# Altium schematic sheet PWL File.SchDoc: PWL File
size A4; Organization: Altium Limited; Address1: L3, 12a Rodborough Rd; Address2: Frenchs Forest; Address3: NSW; Address4: Australia 2086; DocumentNumber: 1; SheetNumber: 1; SheetTotal: 1
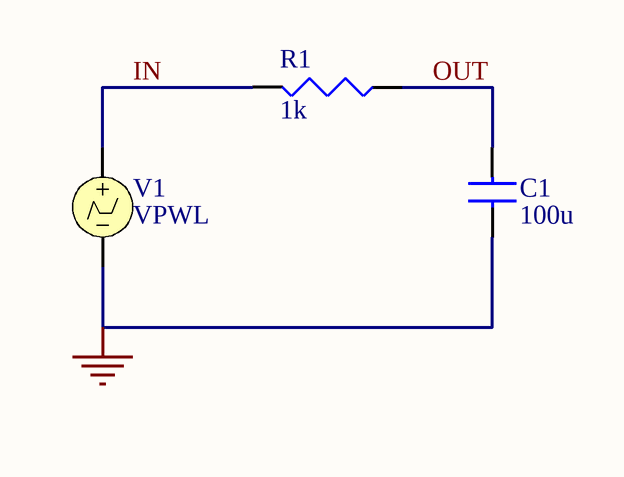
[diagram p0: PWL File.SchDoc]

## Parts
C1  value 100u  (hidden comment: *)
R1  value 1k  (hidden comment: *)
V1  VPWL

## Nets
GND: C1.2 V1.2
IN: R1.1(TOP) V1.1
OUT: C1.1 R1.2(BOT)

## Notes on the sheet
- Title
- Size:
- Date:
- A4
- Number:
- Time:
- Revision:
- Sheet
- of
- File:

## Library data of the parts
C1 = CAP: Capacitor
R1 = RES: Resistor
V1 = VPWL: Piecewise Linear Voltage Source